# Altium schematic sheet Power Distribution Unit.SchDoc
size A3; SheetNumber: 1; SheetTotal: 1
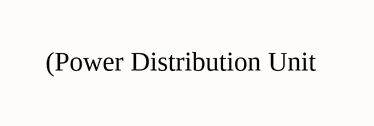
[diagram p0: Power Distribution Unit.SchDoc]

## Notes on the sheet
- (Power Distribution Unit